# Altium schematic sheet SC942C-0B_Borniers.SchDoc: Borniers
size 393 x 270 mm; CompanyName: Seccom; Address1: 521, rue du capt. François Garbit; Address2: 69440 Mornant; Address3: seccom@seccom.fr; Address4: www.seccom.fr; DocumentNumber: 8; SheetNumber: 8; SheetTotal: 8; PageSetup: Record=PageOptions|CenterHorizontal=True|CenterVertical=True|PrintScale=0.71|XCorrection=1.00|YCorrection=1.00|PrintKind=0|BorderSize=5000000|LeftOffset=0|BottomOffset=0|Orientation=2|PaperLength=1000|PaperWidth=1000|Scale=100|PaperSource=7|PrintQuality=-4|MediaType=1|DitherType=10|PaperKind=A4|PrintScaleMode=1
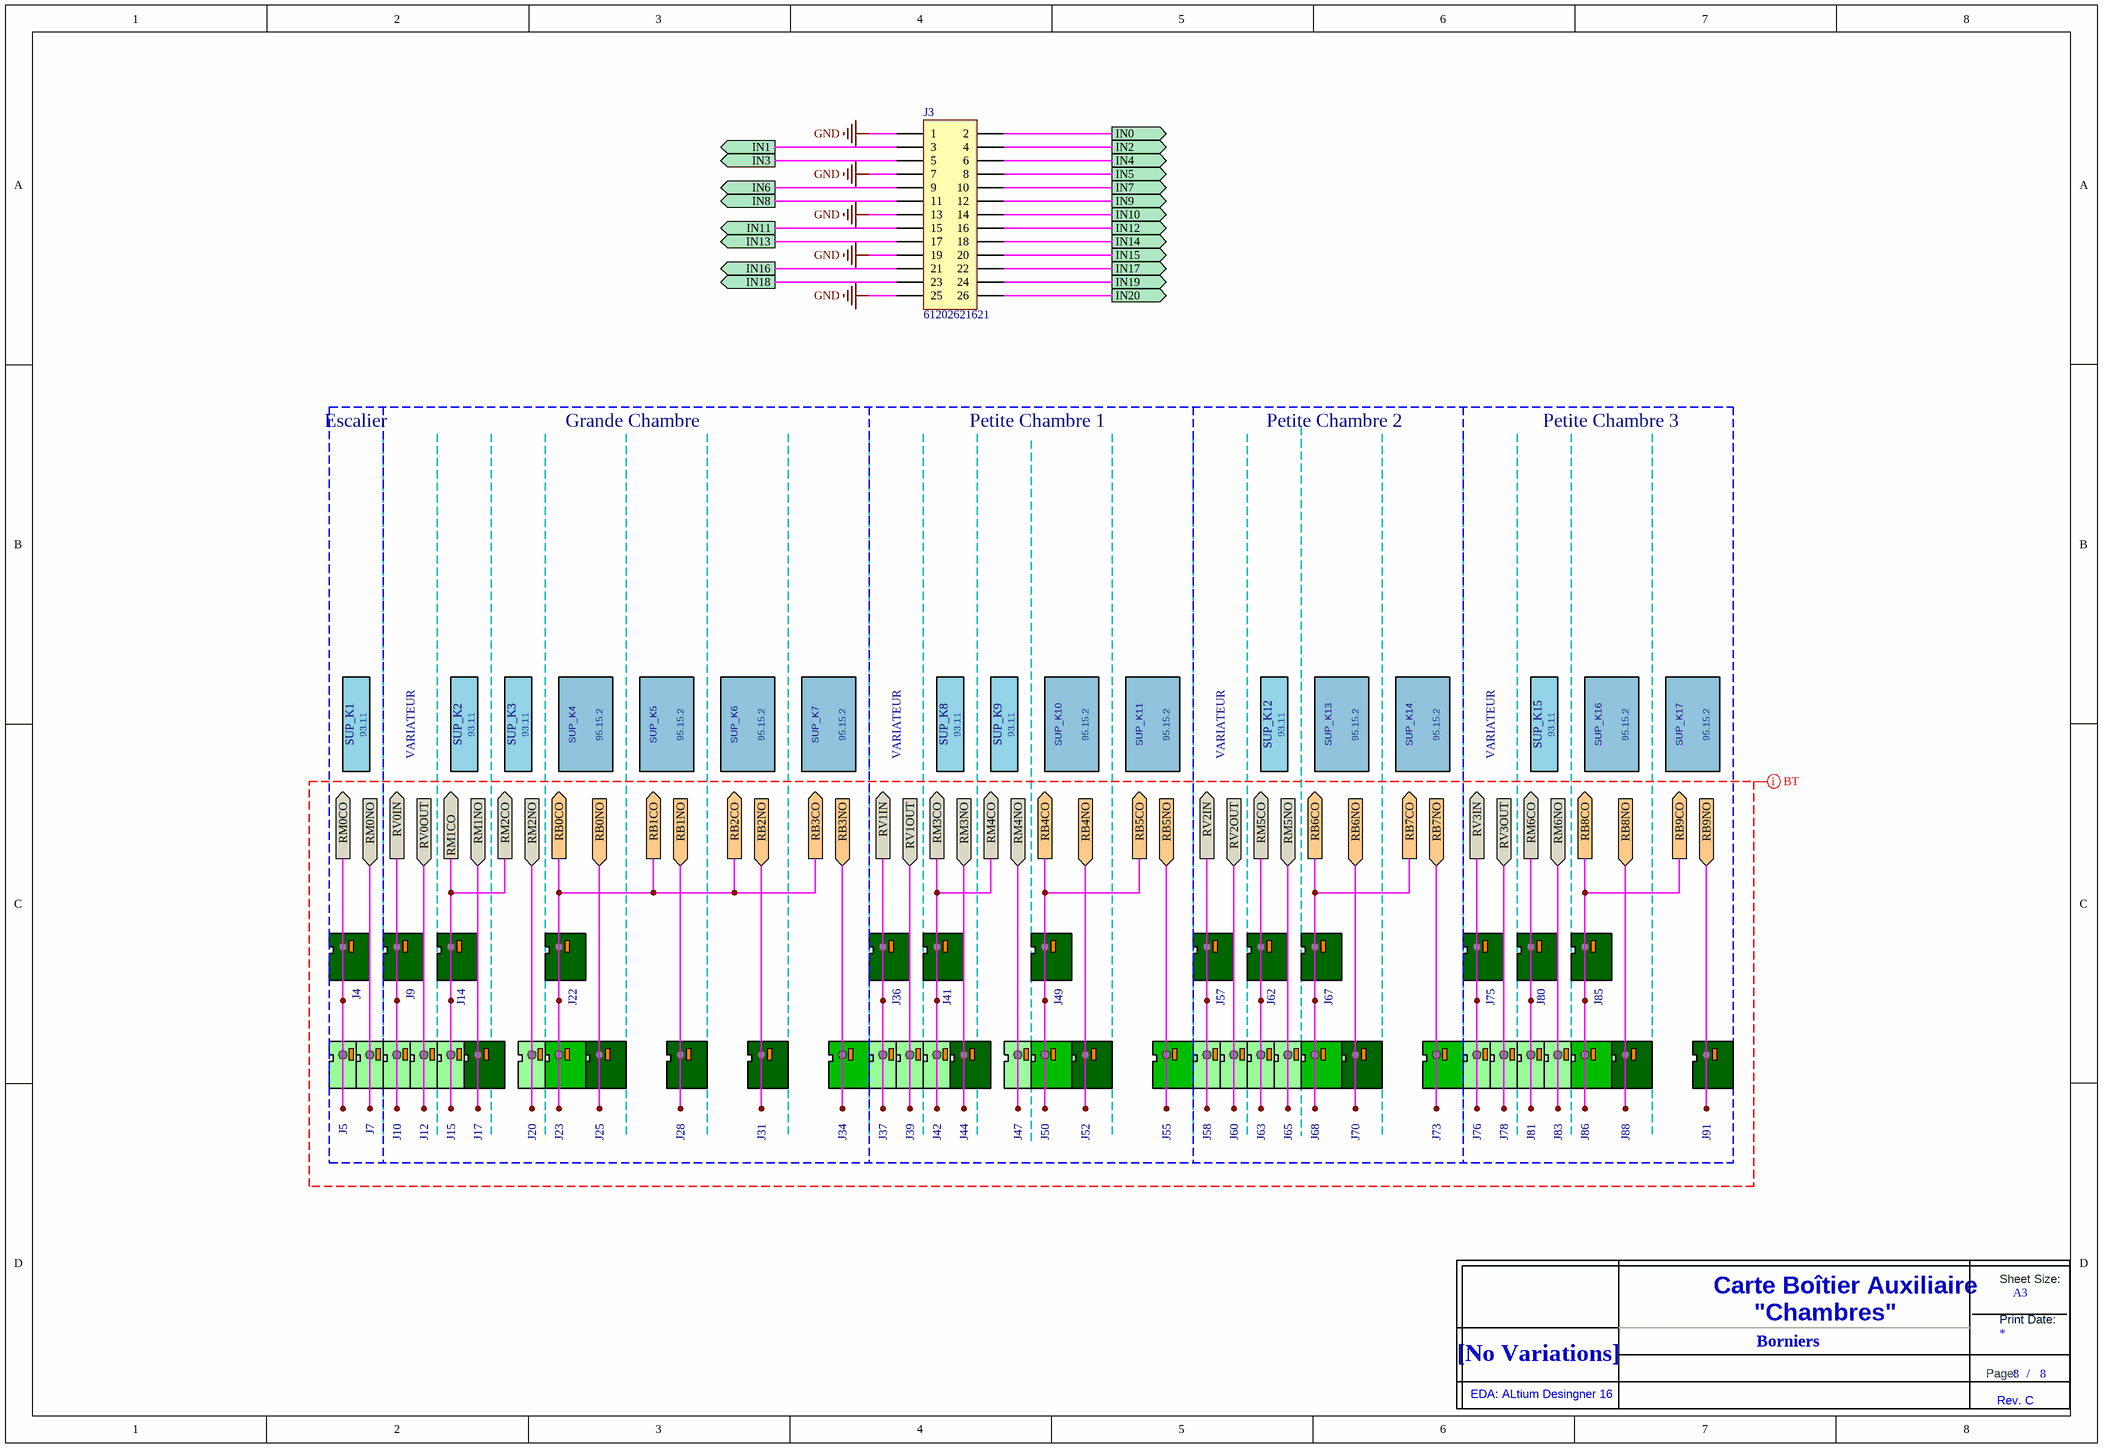
[diagram p0: SC942C-0B_Borniers.SchDoc]

## Parts
J3  61202621621  [IDC2P54_26P]
J4  BRESS_CI_D_7.62_01_FFKDSA1/V2  [BRESS_FFKDSA1/V2-7,62_P1.3]  (value not drawn)
J5  BRESS_CI_D_5.08_01_FFKDS/V2  [BRESS_FFKDS/V2-5,08_P1.3]  (value not drawn)
J7  BRESS_CI_D_5.08_01_FFKDS/V2  [BRESS_FFKDS/V2-5,08_P1.3]  (value not drawn)
J9  BRESS_CI_D_7.62_01_FFKDSA1/V2  [BRESS_FFKDSA1/V2-7,62_P1.3]  (value not drawn)
J10  BRESS_CI_D_5.08_01_FFKDS/V2  [BRESS_FFKDS/V2-5,08_P1.3]  (value not drawn)
J12  BRESS_CI_D_5.08_01_FFKDS/V2  [BRESS_FFKDS/V2-5,08_P1.3]  (value not drawn)
J14  BRESS_CI_D_7.62_01_FFKDSA1/V2  [BRESS_FFKDSA1/V2-7,62_P1.3]  (value not drawn)
J15  BRESS_CI_D_5.08_01_FFKDS/V2  [BRESS_FFKDS/V2-5,08_P1.3]  (value not drawn)
J17  BRESS_CI_D_7.62_01_FFKDSA1/V2  [BRESS_FFKDSA1/V2-7,62_P1.3]  (value not drawn)
J20  BRESS_CI_D_5.08_01_FFKDS/V2  [BRESS_FFKDS/V2-5,08_P1.3]  (value not drawn)
J22  BRESS_CI_D_7.62_01_FFKDSA1/V2  [BRESS_FFKDSA1/V2-7,62_P1.3]  (value not drawn)
J23  BRESS_CI_D_7.62_01_FFKDSA/V2  [BRESS_FFKDSA/V2-7,62_P1.3]  (value not drawn)
J25  BRESS_CI_D_7.62_01_FFKDSA1/V2  [BRESS_FFKDSA1/V2-7,62_P1.3]  (value not drawn)
J28  BRESS_CI_D_7.62_01_FFKDSA1/V2  [BRESS_FFKDSA1/V2-7,62_P1.3]  (value not drawn)
J31  BRESS_CI_D_7.62_01_FFKDSA1/V2  [BRESS_FFKDSA1/V2-7,62_P1.3]  (value not drawn)
J34  BRESS_CI_D_7.62_01_FFKDSA/V2  [BRESS_FFKDSA/V2-7,62_P1.3]  (value not drawn)
J36  BRESS_CI_D_7.62_01_FFKDSA1/V2  [BRESS_FFKDSA1/V2-7,62_P1.3]  (value not drawn)
J37  BRESS_CI_D_5.08_01_FFKDS/V2  [BRESS_FFKDS/V2-5,08_P1.3]  (value not drawn)
J39  BRESS_CI_D_5.08_01_FFKDS/V2  [BRESS_FFKDS/V2-5,08_P1.3]  (value not drawn)
J41  BRESS_CI_D_7.62_01_FFKDSA1/V2  [BRESS_FFKDSA1/V2-7,62_P1.3]  (value not drawn)
J42  BRESS_CI_D_5.08_01_FFKDS/V2  [BRESS_FFKDS/V2-5,08_P1.3]  (value not drawn)
J44  BRESS_CI_D_7.62_01_FFKDSA1/V2  [BRESS_FFKDSA1/V2-7,62_P1.3]  (value not drawn)
J47  BRESS_CI_D_5.08_01_FFKDS/V2  [BRESS_FFKDS/V2-5,08_P1.3]  (value not drawn)
J49  BRESS_CI_D_7.62_01_FFKDSA1/V2  [BRESS_FFKDSA1/V2-7,62_P1.3]  (value not drawn)
J50  BRESS_CI_D_7.62_01_FFKDSA/V2  [BRESS_FFKDSA/V2-7,62_P1.3]  (value not drawn)
J52  BRESS_CI_D_7.62_01_FFKDSA1/V2  [BRESS_FFKDSA1/V2-7,62_P1.3]  (value not drawn)
J55  BRESS_CI_D_7.62_01_FFKDSA/V2  [BRESS_FFKDSA/V2-7,62_P1.3]  (value not drawn)
J57  BRESS_CI_D_7.62_01_FFKDSA1/V2  [BRESS_FFKDSA1/V2-7,62_P1.3]  (value not drawn)
J58  BRESS_CI_D_5.08_01_FFKDS/V2  [BRESS_FFKDS/V2-5,08_P1.3]  (value not drawn)
J60  BRESS_CI_D_5.08_01_FFKDS/V2  [BRESS_FFKDS/V2-5,08_P1.3]  (value not drawn)
J62  BRESS_CI_D_7.62_01_FFKDSA1/V2  [BRESS_FFKDSA1/V2-7,62_P1.3]  (value not drawn)
J63  BRESS_CI_D_5.08_01_FFKDS/V2  [BRESS_FFKDS/V2-5,08_P1.3]  (value not drawn)
J65  BRESS_CI_D_5.08_01_FFKDS/V2  [BRESS_FFKDS/V2-5,08_P1.3]  (value not drawn)
J67  BRESS_CI_D_7.62_01_FFKDSA1/V2  [BRESS_FFKDSA1/V2-7,62_P1.3]  (value not drawn)
J68  BRESS_CI_D_7.62_01_FFKDSA/V2  [BRESS_FFKDSA/V2-7,62_P1.3]  (value not drawn)
J70  BRESS_CI_D_7.62_01_FFKDSA1/V2  [BRESS_FFKDSA1/V2-7,62_P1.3]  (value not drawn)
J73  BRESS_CI_D_7.62_01_FFKDSA/V2  [BRESS_FFKDSA/V2-7,62_P1.3]  (value not drawn)
J75  BRESS_CI_D_7.62_01_FFKDSA1/V2  [BRESS_FFKDSA1/V2-7,62_P1.3]  (value not drawn)
J76  BRESS_CI_D_5.08_01_FFKDS/V2  [BRESS_FFKDS/V2-5,08_P1.3]  (value not drawn)
J78  BRESS_CI_D_5.08_01_FFKDS/V2  [BRESS_FFKDS/V2-5,08_P1.3]  (value not drawn)
J80  BRESS_CI_D_7.62_01_FFKDSA1/V2  [BRESS_FFKDSA1/V2-7,62_P1.3]  (value not drawn)
J81  BRESS_CI_D_5.08_01_FFKDS/V2  [BRESS_FFKDS/V2-5,08_P1.3]  (value not drawn)
J83  BRESS_CI_D_5.08_01_FFKDS/V2  [BRESS_FFKDS/V2-5,08_P1.3]  (value not drawn)
J85  BRESS_CI_D_7.62_01_FFKDSA1/V2  [BRESS_FFKDSA1/V2-7,62_P1.3]  (value not drawn)
J86  BRESS_CI_D_7.62_01_FFKDSA/V2  [BRESS_FFKDSA/V2-7,62_P1.3]  (value not drawn)
J88  BRESS_CI_D_7.62_01_FFKDSA1/V2  [BRESS_FFKDSA1/V2-7,62_P1.3]  (value not drawn)
J91  BRESS_CI_D_7.62_01_FFKDSA1/V2  [BRESS_FFKDSA1/V2-7,62_P1.3]  (value not drawn)
SUP_K1  value 93.11  [RELAY-SUPPORT_FINDER_SERIE93]  (hidden comment: RELAY-SUPPORT_93.11)
SUP_K2  value 93.11  [RELAY-SUPPORT_FINDER_SERIE93]  (hidden comment: RELAY-SUPPORT_93.11)
SUP_K3  value 93.11  [RELAY-SUPPORT_FINDER_SERIE93]  (hidden comment: RELAY-SUPPORT_93.11)
SUP_K4  value 95.15.2  [RELAY-SUPPORT_FINDER_SERIE95]  (hidden comment: RELAY-SUPPORT_95.15.2)
SUP_K5  value 95.15.2  [RELAY-SUPPORT_FINDER_SERIE95]  (hidden comment: RELAY-SUPPORT_95.15.2)
SUP_K6  value 95.15.2  [RELAY-SUPPORT_FINDER_SERIE95]  (hidden comment: RELAY-SUPPORT_95.15.2)
SUP_K7  value 95.15.2  [RELAY-SUPPORT_FINDER_SERIE95]  (hidden comment: RELAY-SUPPORT_95.15.2)
SUP_K8  value 93.11  [RELAY-SUPPORT_FINDER_SERIE93]  (hidden comment: RELAY-SUPPORT_93.11)
SUP_K9  value 93.11  [RELAY-SUPPORT_FINDER_SERIE93]  (hidden comment: RELAY-SUPPORT_93.11)
SUP_K10  value 95.15.2  [RELAY-SUPPORT_FINDER_SERIE95]  (hidden comment: RELAY-SUPPORT_95.15.2)
SUP_K11  value 95.15.2  [RELAY-SUPPORT_FINDER_SERIE95]  (hidden comment: RELAY-SUPPORT_95.15.2)
SUP_K12  value 93.11  [RELAY-SUPPORT_FINDER_SERIE93]  (hidden comment: RELAY-SUPPORT_93.11)
SUP_K13  value 95.15.2  [RELAY-SUPPORT_FINDER_SERIE95]  (hidden comment: RELAY-SUPPORT_95.15.2)
SUP_K14  value 95.15.2  [RELAY-SUPPORT_FINDER_SERIE95]  (hidden comment: RELAY-SUPPORT_95.15.2)
SUP_K15  value 93.11  [RELAY-SUPPORT_FINDER_SERIE93]  (hidden comment: RELAY-SUPPORT_93.11)
SUP_K16  value 95.15.2  [RELAY-SUPPORT_FINDER_SERIE95]  (hidden comment: RELAY-SUPPORT_95.15.2)
SUP_K17  value 95.15.2  [RELAY-SUPPORT_FINDER_SERIE95]  (hidden comment: RELAY-SUPPORT_95.15.2)
Title_new?  DNI  (value not drawn)  (graphical)

## Ports
IN0 (out), IN1 (out), IN2 (out), IN3 (out), IN4 (out), IN5 (out), IN6 (out), IN7 (out), IN8 (out), IN9 (out), IN10 (out), IN11 (out), IN12 (out), IN13 (out), IN14 (out), IN15 (out), IN16 (out), IN17 (out), IN18 (out), IN19 (out), IN20 (out), RB0CO (out), RB0NO (in), RB1CO (out), RB1NO (in), RB2CO (out), RB2NO (in), RB3CO (out), RB3NO (in), RB4CO (out), RB4NO (in), RB5CO (out), RB5NO (in), RB6CO (out), RB6NO (in), RB7CO (out), RB7NO (in), RB8CO (out), RB8NO (in), RB9CO (out), RB9NO (in), RM0CO (out), RM0NO (in), RM1CO (out), RM1NO (in), RM2CO (out), RM2NO (in), RM3CO (out), RM3NO (in), RM4CO (out), RM4NO (in), RM5CO (out), RM5NO (in), RM6CO (out), RM6NO (in), RV0IN (out), RV0OUT (in), RV1IN (out), RV1OUT (in), RV2IN (out), RV2OUT (in), RV3IN (out), RV3OUT (in)

## Nets
GND: J3.1 J3.7 J3.13 J3.19 J3.25
IN0: J3.2 ; port IN0
IN1: J3.3 ; port IN1
IN2: J3.4 ; port IN2
IN3: J3.5 ; port IN3
IN4: J3.6 ; port IN4
IN5: J3.8 ; port IN5
IN6: J3.9 ; port IN6
IN7: J3.10 ; port IN7
IN8: J3.11 ; port IN8
IN9: J3.12 ; port IN9
IN10: J3.14 ; port IN10
IN11: J3.15 ; port IN11
IN12: J3.16 ; port IN12
IN13: J3.17 ; port IN13
IN14: J3.18 ; port IN14
IN15: J3.20 ; port IN15
IN16: J3.21 ; port IN16
IN17: J3.22 ; port IN17
IN18: J3.23 ; port IN18
IN19: J3.24 ; port IN19
IN20: J3.26 ; port IN20
RB0CO: J22.1 J22.2 J23.1 J23.2 ; port RB3CO, port RB2CO, port RB1CO, port RB0CO
RB0NO: J25.1 J25.2 ; port RB0NO
RB1NO: J28.1 J28.2 ; port RB1NO
RB2NO: J31.1 J31.2 ; port RB2NO
RB3NO: J34.1 J34.2 ; port RB3NO
RB4CO: J49.1 J49.2 J50.1 J50.2 ; port RB5CO, port RB4CO
RB4NO: J52.1 J52.2 ; port RB4NO
RB5NO: J55.1 J55.2 ; port RB5NO
RB6CO: J67.1 J67.2 J68.1 J68.2 ; port RB7CO, port RB6CO
RB6NO: J70.1 J70.2 ; port RB6NO
RB7NO: J73.1 J73.2 ; port RB7NO
RB8CO: J85.1 J85.2 J86.1 J86.2 ; port RB9CO, port RB8CO
RB8NO: J88.1 J88.2 ; port RB8NO
RB9NO: J91.1 J91.2 ; port RB9NO
RM0CO: J4.1 J4.2 J5.1 J5.2 ; port RM0CO
RM0NO: J7.1 J7.2 ; port RM0NO
RM1CO: J14.1 J14.2 J15.1 J15.2 ; port RM1CO, port RM2CO
RM1NO: J17.1 J17.2 ; port RM1NO
RM2NO: J20.1 J20.2 ; port RM2NO
RM3CO: J41.1 J41.2 J42.1 J42.2 ; port RM3CO, port RM4CO
RM3NO: J44.1 J44.2 ; port RM3NO
RM4NO: J47.1 J47.2 ; port RM4NO
RM5CO: J62.1 J62.2 J63.1 J63.2 ; port RM5CO
RM5NO: J65.1 J65.2 ; port RM5NO
RM6CO: J80.1 J80.2 J81.1 J81.2 ; port RM6CO
RM6NO: J83.1 J83.2 ; port RM6NO
RV0IN: J9.1 J9.2 J10.1 J10.2 ; port RV0IN
RV0OUT: J12.1 J12.2 ; port RV0OUT
RV1IN: J36.1 J36.2 J37.1 J37.2 ; port RV1IN
RV1OUT: J39.1 J39.2 ; port RV1OUT
RV2IN: J57.1 J57.2 J58.1 J58.2 ; port RV2IN
RV2OUT: J60.1 J60.2 ; port RV2OUT
RV3IN: J75.1 J75.2 J76.1 J76.2 ; port RV3IN
RV3OUT: J78.1 J78.2 ; port RV3OUT

## Layout directives
net class BT: (no net found under the mark)

## Notes on the sheet
- Escalier
- Grande Chambre
- Petite Chambre 1
- Petite Chambre 2
- Petite Chambre 3
- VARIATEUR
- Borniers
- (in symbol Title_new_1) Sheet Size:; Carte Boîtier Auxiliaire; A3; "Chambres"; Print Date:; [No Variations]; Page:; /; EDA: ALtium Desingner 16; Rev. C

## Library data of the parts
J3 = Header 13X2: 26 Positions Header, Shrouded Connector 0.100" (2.54mm) Through Hole Gold; Manufacturer: Wurth Electronics Inc; Fabricant: Wurth Elektronik; Supplier 1: Digi-Key; Supplier Part Number 1: 732-2097-ND; Manufacturer Part Number: 61202621621; Reference: 61202621621; Value: 61202621621
J4 J9 J14 J17 J22 J25 J28 J31 J36 J41 J44 J49 J52 J57 J62 J67 J70 J75 J80 J85 J88 J91 = BRESS_CI_D_7.62_01_FFKDSA1/V2: Bornier à connexion par ressorts/déconnexion par levier, série FFKDSA1/V2, e7.62, 1x1pts, droit, juxtaposable, 500V/17.5A, AWG22~16, Vert/Orange; Creation: LJ (21/11/11); Boitier: 7.62x10_h15.8_e7.62_p1.3mm; Remarque: {Remarque}; Fabricant: Phoenix Contact; Ref Fab: 1790487; Coeff: 1; Value: FFKDSA1/V2-7,62; Verification: *; ComponentLink1URL: o:\_Documentation\Datasheets\Phoenix\FFKDSA1-V2_7,62_1790487.pdf; ComponentLink2URL: o:\_Documentation\Datasheets\_BOITIERS\; Config: *; ComponentLink1Description: Datasheet; ComponentLink2Description: Datasheet
J5 J7 J10 J12 J15 J20 J37 J39 J42 J47 J58 J60 J63 J65 J76 J78 J81 J83 = BRESS_CI_D_5.08_01_FFKDS/V2: Bornier à connexion par ressorts/déconnexion par levier, série FFKDS/V2, e5.08, 1x1pts, droit, juxtaposable, 320V/15A, AWG22~16, Vert/Orange; Creation: LJ (21/11/11); Boitier: 5.08x10_h15.8_e5.08_p1.3mm; Remarque: {Remarque}; Fabricant: Phoenix Contact; Ref Fab: 1790348; Coeff: 1; Value: FFKDS/V2-5,08; Verification: *; ComponentLink1URL: o:\_Documentation\Datasheets\Phoenix\FFKDS-V2_5,08_1790348.pdf; ComponentLink2URL: o:\_Documentation\Datasheets\_BOITIERS\; Config: *; ComponentLink1Description: Datasheet; ComponentLink2Description: Datasheet
J23 J34 J50 J55 J68 J73 J86 = BRESS_CI_D_7.62_01_FFKDSA/V2: Bornier à connexion par ressorts/déconnexion par levier, série FFKDSA/V2, e7.62, 1x1pts, droit, juxtaposable, 500V/17.5A, AWG22~16, Vert/Orange; Creation: LJ (21/11/11); Boitier: 7.62x10_h15.8_e7.62_p1.3mm; Remarque: {Remarque}; Fabricant: Phoenix Contact; Ref Fab: 1790377; Coeff: 1; Value: FFKDSA/V2-7,62; Verification: *; ComponentLink1URL: o:\_Documentation\Datasheets\Phoenix\FFKDSA-V2_7,62_1790377.pdf; ComponentLink2URL: o:\_Documentation\Datasheets\_BOITIERS\; Config: *; ComponentLink1Description: Datasheet; ComponentLink2Description: Datasheet
SUP_K1-SUP_K3 SUP_K8 SUP_K9 SUP_K12 SUP_K15 = RELAY-SUPPORT_93.11: Suppor série 93 pour relais Finder séries 34, 250V/6A, Bleu; Creation: LJ (24/11/11); Remarque: {Remarque}; Coeff: 1; Fabricant: Finder; Ref Fab: 93.11; ComponentLink1URL: o:\_Documentation\Datasheets\Finder\Relais_Serie_34.pdf; ComponentLink2URL: o:\_Documentation\Datasheets\; Config: *; ComponentLink1Description: Datasheet; ComponentLink2Description: Datasheet Boitier
SUP_K4-SUP_K7 SUP_K10 SUP_K11 SUP_K13 SUP_K14 SUP_K16 SUP_K17 = RELAY-SUPPORT_95.15.2: Suppor série 95 pour relais Finder séries 40, 250V/10A, Bleu, sans Etrier; Creation: LJ (11/06/12); Remarque: {Remarque}; Coeff: 1; Fabricant: Finder; Ref Fab: 95.15.2; ComponentLink1URL: o:\_Documentation\Datasheets\Finder\Relais_Serie_40.pdf; ComponentLink2URL: o:\_Documentation\Datasheets\; Config: *; ComponentLink1Description: Datasheet; ComponentLink2Description: Datasheet Boitier
Title_new? = Title_new_1